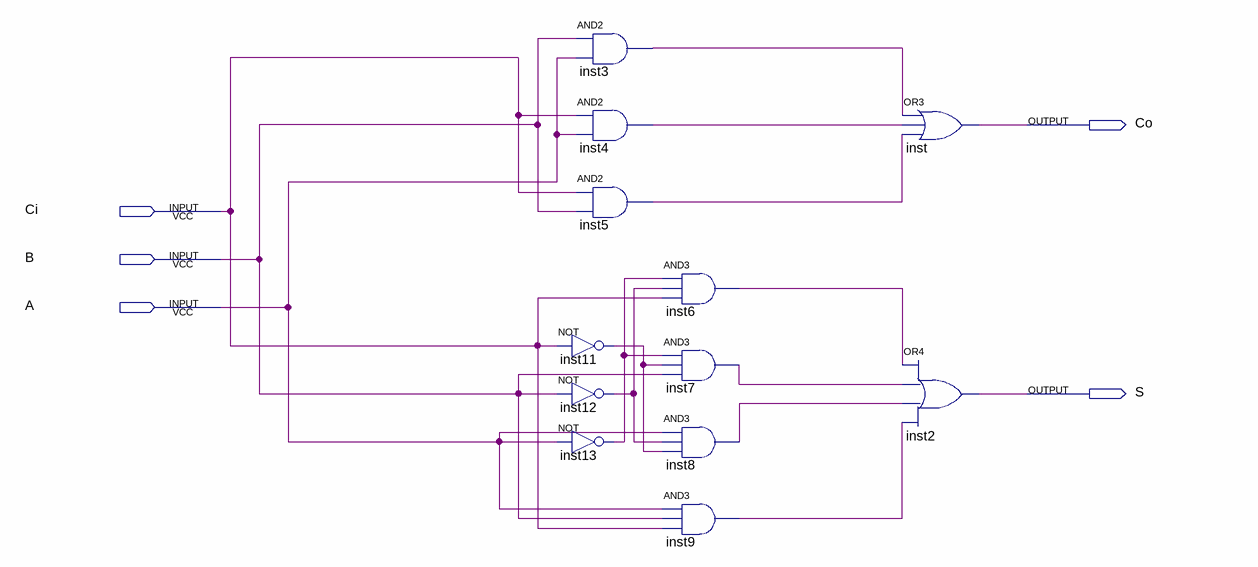
[diagram p0: schematic sheet]
// Quartus schematic Somador.bdf as structural Verilog: 12 symbols, 5 pins
module Somador (
  input  Ci,
  input  B,
  input  A,
  output Co,
  output S
);

  wire inst3_out, inst4_out, inst5_out, inst6_out, inst7_out, inst8_out, inst9_out, inst11_out, inst12_out,
       inst13_out;

  and inst3 (inst3_out, B, A);
  and inst4 (inst4_out, Ci, A);
  and inst5 (inst5_out, Ci, B);
  not inst11 (inst11_out, Ci);
  not inst12 (inst12_out, B);
  not inst13 (inst13_out, A);
  and inst6 (inst6_out, inst13_out, inst12_out, Ci);
  and inst7 (inst7_out, inst13_out, inst11_out, B);
  and inst8 (inst8_out, A, inst12_out, inst11_out);
  and inst9 (inst9_out, A, B, Ci);
  or inst (Co, inst3_out, inst4_out, inst5_out);
  or inst2 (S, inst6_out, inst7_out, inst8_out, inst9_out);
endmodule
